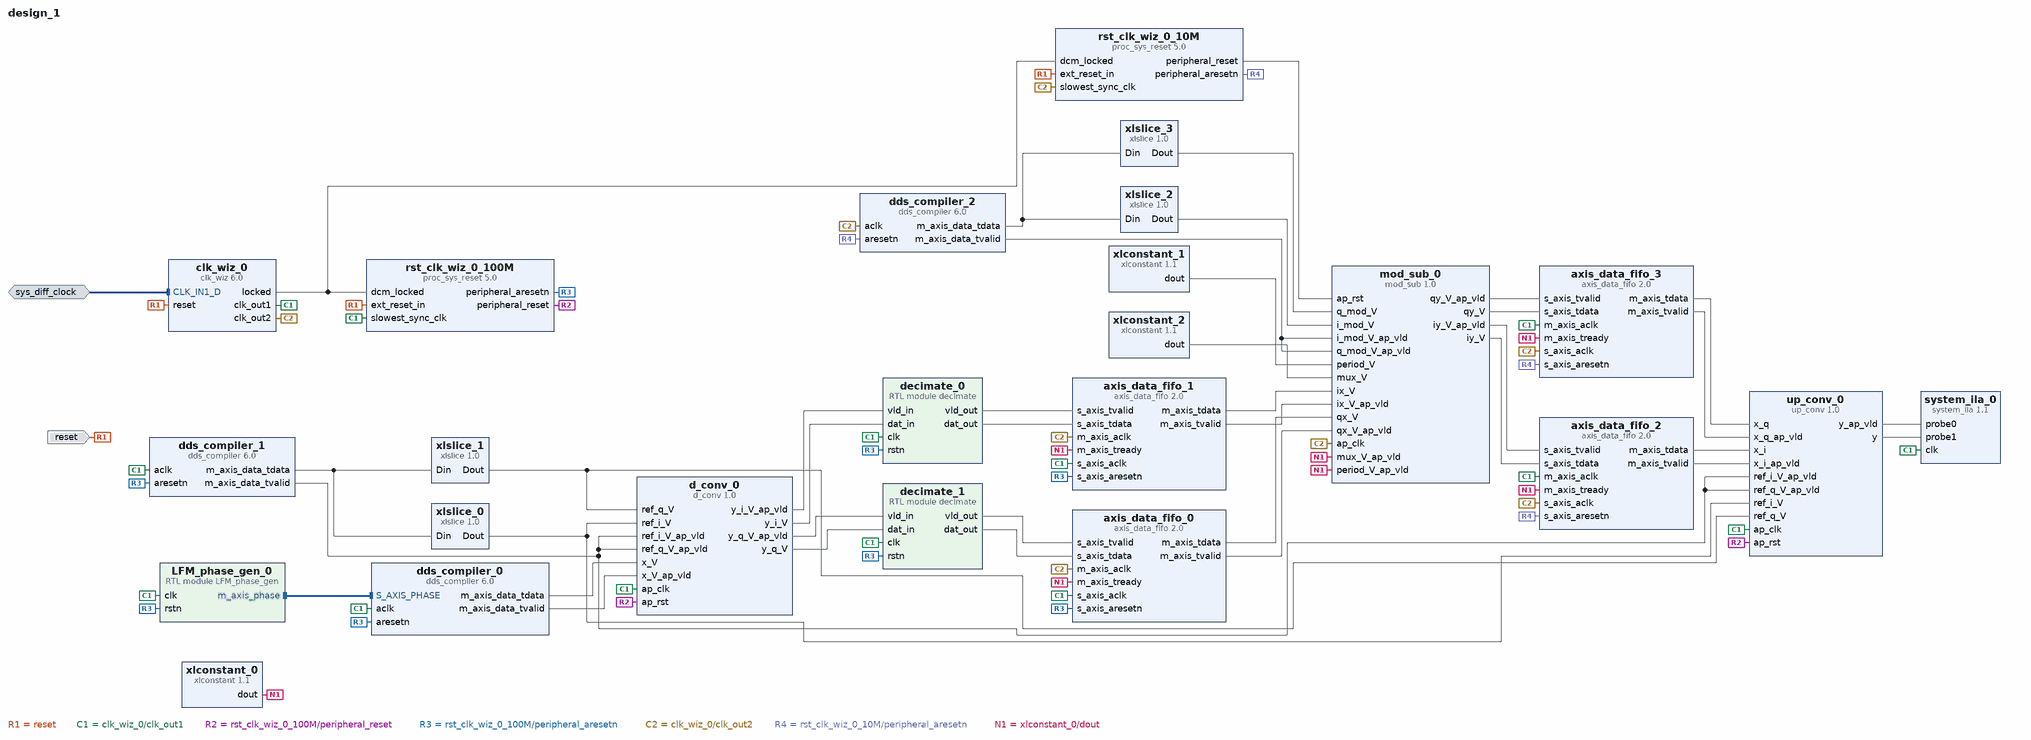
[diagram p0: block diagram of the top level]
# Vivado block design design_1, xc7z045ffg900-2, Vivado 2019.1.2
create_bd_design design_1

create_bd_intf_port -mode Slave -vlnv xilinx.com:interface:diff_clock_rtl:1.0 sys_diff_clock
set_property -dict {CONFIG.FREQ_HZ 200000000} [get_bd_intf_ports sys_diff_clock]
create_bd_port -dir I -type rst reset
set_property -dict {CONFIG.POLARITY ACTIVE_HIGH} [get_bd_ports reset]

create_bd_cell -type ip -vlnv xilinx.com:ip:dds_compiler:6.0 dds_compiler_0
set_property -dict [list \
  CONFIG.DATA_Has_TLAST Not_Required \
  CONFIG.Has_ARESETn true \
  CONFIG.Has_Phase_Out false \
  CONFIG.M_DATA_Has_TUSER Not_Required \
  CONFIG.Noise_Shaping None \
  CONFIG.Output_Frequency1 0 \
  CONFIG.Output_Selection Cosine \
  CONFIG.Output_Width 8 \
  CONFIG.PINC1 0 \
  CONFIG.Parameter_Entry Hardware_Parameters \
  CONFIG.Phase_Increment Streaming \
  CONFIG.Phase_Width 16 \
  CONFIG.S_PHASE_Has_TUSER Not_Required \
] [get_bd_cells dds_compiler_0]
create_bd_cell -type ip -vlnv xilinx.com:ip:dds_compiler:6.0 dds_compiler_1
set_property -dict [list \
  CONFIG.Has_ARESETn true \
  CONFIG.Has_Phase_Out false \
  CONFIG.M_DATA_Has_TUSER Not_Required \
  CONFIG.Noise_Shaping None \
  CONFIG.Output_Frequency1 0 \
  CONFIG.Output_Width 8 \
  CONFIG.PINC1 0100110011001101 \
  CONFIG.Parameter_Entry Hardware_Parameters \
  CONFIG.Phase_Width 16 \
] [get_bd_cells dds_compiler_1]
create_bd_cell -type ip -vlnv xilinx.com:ip:xlslice:1.0 xlslice_0
set_property -dict {CONFIG.DIN_FROM 7 CONFIG.DIN_TO 0 CONFIG.DIN_WIDTH 16 CONFIG.DOUT_WIDTH 8} [get_bd_cells xlslice_0]
create_bd_cell -type ip -vlnv xilinx.com:ip:xlslice:1.0 xlslice_1
set_property -dict {CONFIG.DIN_FROM 15 CONFIG.DIN_TO 8 CONFIG.DIN_WIDTH 16 CONFIG.DOUT_WIDTH 8} [get_bd_cells xlslice_1]
create_bd_cell -type module -reference LFM_phase_gen LFM_phase_gen_0
create_bd_cell -type ip -vlnv xilinx.com:ip:clk_wiz:6.0 clk_wiz_0
set_property -dict [list \
  CONFIG.CLKOUT2_JITTER 178.053 \
  CONFIG.CLKOUT2_PHASE_ERROR 89.971 \
  CONFIG.CLKOUT2_REQUESTED_OUT_FREQ 10.000 \
  CONFIG.CLKOUT2_USED true \
  CONFIG.CLK_IN1_BOARD_INTERFACE sys_diff_clock \
  CONFIG.MMCM_CLKOUT1_DIVIDE 100 \
  CONFIG.NUM_OUT_CLKS 2 \
  CONFIG.RESET_BOARD_INTERFACE reset \
  CONFIG.USE_BOARD_FLOW true \
] [get_bd_cells clk_wiz_0]
create_bd_cell -type ip -vlnv xilinx.com:hls:d_conv:1.0 d_conv_0
create_bd_cell -type ip -vlnv xilinx.com:ip:proc_sys_reset:5.0 rst_clk_wiz_0_100M
create_bd_cell -type ip -vlnv xilinx.com:ip:system_ila:1.1 system_ila_0
set_property -dict {CONFIG.C_MON_TYPE NATIVE CONFIG.C_NUM_OF_PROBES 2} [get_bd_cells system_ila_0]
create_bd_cell -type module -reference decimate decimate_0
create_bd_cell -type module -reference decimate decimate_1
create_bd_cell -type ip -vlnv xilinx.com:ip:axis_data_fifo:2.0 axis_data_fifo_0
set_property -dict {CONFIG.FIFO_DEPTH 16 CONFIG.IS_ACLK_ASYNC 1 CONFIG.TDATA_NUM_BYTES 4} [get_bd_cells axis_data_fifo_0]
create_bd_cell -type ip -vlnv xilinx.com:ip:axis_data_fifo:2.0 axis_data_fifo_1
set_property -dict {CONFIG.FIFO_DEPTH 16 CONFIG.IS_ACLK_ASYNC 1 CONFIG.TDATA_NUM_BYTES 4} [get_bd_cells axis_data_fifo_1]
create_bd_cell -type ip -vlnv xilinx.com:ip:axis_data_fifo:2.0 axis_data_fifo_2
set_property -dict {CONFIG.FIFO_DEPTH 16 CONFIG.IS_ACLK_ASYNC 1 CONFIG.TDATA_NUM_BYTES 4} [get_bd_cells axis_data_fifo_2]
create_bd_cell -type ip -vlnv xilinx.com:ip:axis_data_fifo:2.0 axis_data_fifo_3
set_property -dict {CONFIG.FIFO_DEPTH 16 CONFIG.IS_ACLK_ASYNC 1 CONFIG.TDATA_NUM_BYTES 4} [get_bd_cells axis_data_fifo_3]
create_bd_cell -type ip -vlnv xilinx.com:hls:mod_sub:1.0 mod_sub_0
create_bd_cell -type ip -vlnv xilinx.com:ip:dds_compiler:6.0 dds_compiler_2
set_property -dict [list \
  CONFIG.DDS_Clock_Rate 10 \
  CONFIG.Has_ARESETn true \
  CONFIG.Has_Phase_Out false \
  CONFIG.M_DATA_Has_TUSER Not_Required \
  CONFIG.Negative_Sine true \
  CONFIG.Noise_Shaping None \
  CONFIG.Output_Frequency1 0 \
  CONFIG.Output_Width 8 \
  CONFIG.PINC1 0000110011001101 \
  CONFIG.Parameter_Entry Hardware_Parameters \
  CONFIG.Phase_Width 16 \
] [get_bd_cells dds_compiler_2]
create_bd_cell -type ip -vlnv xilinx.com:ip:proc_sys_reset:5.0 rst_clk_wiz_0_10M
create_bd_cell -type ip -vlnv xilinx.com:ip:xlslice:1.0 xlslice_2
set_property -dict {CONFIG.DIN_FROM 7 CONFIG.DIN_TO 0 CONFIG.DIN_WIDTH 16 CONFIG.DOUT_WIDTH 8} [get_bd_cells xlslice_2]
create_bd_cell -type ip -vlnv xilinx.com:ip:xlslice:1.0 xlslice_3
set_property -dict {CONFIG.DIN_FROM 15 CONFIG.DIN_TO 8 CONFIG.DIN_WIDTH 16 CONFIG.DOUT_WIDTH 8} [get_bd_cells xlslice_3]
create_bd_cell -type ip -vlnv xilinx.com:ip:xlconstant:1.1 xlconstant_0
create_bd_cell -type ip -vlnv xilinx.com:ip:xlconstant:1.1 xlconstant_1
set_property -dict {CONFIG.CONST_VAL 100 CONFIG.CONST_WIDTH 8} [get_bd_cells xlconstant_1]
create_bd_cell -type ip -vlnv xilinx.com:ip:xlconstant:1.1 xlconstant_2
set_property -dict {CONFIG.CONST_VAL 0 CONFIG.CONST_WIDTH 2} [get_bd_cells xlconstant_2]
create_bd_cell -type ip -vlnv xilinx.com:hls:up_conv:1.0 up_conv_0

# ---- connections ----

connect_bd_intf_net [get_bd_intf_pins LFM_phase_gen_0/m_axis_phase] [get_bd_intf_pins dds_compiler_0/S_AXIS_PHASE]
connect_bd_intf_net [get_bd_intf_ports sys_diff_clock] [get_bd_intf_pins clk_wiz_0/CLK_IN1_D]
connect_bd_net [get_bd_ports reset] \
  [get_bd_pins clk_wiz_0/reset] [get_bd_pins rst_clk_wiz_0_100M/ext_reset_in] [get_bd_pins rst_clk_wiz_0_10M/ext_reset_in]
connect_bd_net [get_bd_pins clk_wiz_0/clk_out1] \
  [get_bd_pins d_conv_0/ap_clk] [get_bd_pins rst_clk_wiz_0_100M/slowest_sync_clk] [get_bd_pins LFM_phase_gen_0/clk] \
  [get_bd_pins dds_compiler_0/aclk] [get_bd_pins dds_compiler_1/aclk] [get_bd_pins system_ila_0/clk] \
  [get_bd_pins decimate_0/clk] [get_bd_pins decimate_1/clk] [get_bd_pins axis_data_fifo_1/s_axis_aclk] \
  [get_bd_pins axis_data_fifo_0/s_axis_aclk] [get_bd_pins axis_data_fifo_2/m_axis_aclk] \
  [get_bd_pins axis_data_fifo_3/m_axis_aclk] [get_bd_pins up_conv_0/ap_clk]
connect_bd_net [get_bd_pins clk_wiz_0/locked] [get_bd_pins rst_clk_wiz_0_100M/dcm_locked] [get_bd_pins rst_clk_wiz_0_10M/dcm_locked]
connect_bd_net [get_bd_pins rst_clk_wiz_0_100M/peripheral_reset] [get_bd_pins d_conv_0/ap_rst] [get_bd_pins up_conv_0/ap_rst]
connect_bd_net [get_bd_pins rst_clk_wiz_0_100M/peripheral_aresetn] \
  [get_bd_pins LFM_phase_gen_0/rstn] [get_bd_pins dds_compiler_0/aresetn] [get_bd_pins dds_compiler_1/aresetn] \
  [get_bd_pins decimate_0/rstn] [get_bd_pins decimate_1/rstn] [get_bd_pins axis_data_fifo_1/s_axis_aresetn] \
  [get_bd_pins axis_data_fifo_0/s_axis_aresetn]
connect_bd_net [get_bd_pins dds_compiler_1/m_axis_data_tdata] [get_bd_pins xlslice_0/Din] [get_bd_pins xlslice_1/Din]
connect_bd_net [get_bd_pins dds_compiler_1/m_axis_data_tvalid] \
  [get_bd_pins d_conv_0/ref_i_V_ap_vld] [get_bd_pins d_conv_0/ref_q_V_ap_vld] [get_bd_pins up_conv_0/ref_i_V_ap_vld] \
  [get_bd_pins up_conv_0/ref_q_V_ap_vld]
connect_bd_net [get_bd_pins xlslice_0/Dout] [get_bd_pins d_conv_0/ref_i_V] [get_bd_pins up_conv_0/ref_i_V]
connect_bd_net [get_bd_pins xlslice_1/Dout] [get_bd_pins d_conv_0/ref_q_V] [get_bd_pins up_conv_0/ref_q_V]
connect_bd_net [get_bd_pins dds_compiler_0/m_axis_data_tdata] [get_bd_pins d_conv_0/x_V]
connect_bd_net [get_bd_pins dds_compiler_0/m_axis_data_tvalid] [get_bd_pins d_conv_0/x_V_ap_vld]
connect_bd_net [get_bd_pins d_conv_0/y_i_V_ap_vld] [get_bd_pins decimate_0/vld_in]
connect_bd_net [get_bd_pins d_conv_0/y_i_V] [get_bd_pins decimate_0/dat_in]
connect_bd_net [get_bd_pins d_conv_0/y_q_V_ap_vld] [get_bd_pins decimate_1/vld_in]
connect_bd_net [get_bd_pins d_conv_0/y_q_V] [get_bd_pins decimate_1/dat_in]
connect_bd_net [get_bd_pins clk_wiz_0/clk_out2] \
  [get_bd_pins mod_sub_0/ap_clk] [get_bd_pins rst_clk_wiz_0_10M/slowest_sync_clk] [get_bd_pins dds_compiler_2/aclk] \
  [get_bd_pins axis_data_fifo_0/m_axis_aclk] [get_bd_pins axis_data_fifo_1/m_axis_aclk] \
  [get_bd_pins axis_data_fifo_2/s_axis_aclk] [get_bd_pins axis_data_fifo_3/s_axis_aclk]
connect_bd_net [get_bd_pins rst_clk_wiz_0_10M/peripheral_reset] [get_bd_pins mod_sub_0/ap_rst]
connect_bd_net [get_bd_pins dds_compiler_2/m_axis_data_tdata] [get_bd_pins xlslice_3/Din] [get_bd_pins xlslice_2/Din]
connect_bd_net [get_bd_pins xlslice_2/Dout] [get_bd_pins mod_sub_0/i_mod_V]
connect_bd_net [get_bd_pins xlslice_3/Dout] [get_bd_pins mod_sub_0/q_mod_V]
connect_bd_net [get_bd_pins dds_compiler_2/m_axis_data_tvalid] [get_bd_pins mod_sub_0/i_mod_V_ap_vld] [get_bd_pins mod_sub_0/q_mod_V_ap_vld]
connect_bd_net [get_bd_pins decimate_0/vld_out] [get_bd_pins axis_data_fifo_1/s_axis_tvalid]
connect_bd_net [get_bd_pins decimate_0/dat_out] [get_bd_pins axis_data_fifo_1/s_axis_tdata]
connect_bd_net [get_bd_pins decimate_1/vld_out] [get_bd_pins axis_data_fifo_0/s_axis_tvalid]
connect_bd_net [get_bd_pins decimate_1/dat_out] [get_bd_pins axis_data_fifo_0/s_axis_tdata]
connect_bd_net [get_bd_pins rst_clk_wiz_0_10M/peripheral_aresetn] \
  [get_bd_pins dds_compiler_2/aresetn] [get_bd_pins axis_data_fifo_2/s_axis_aresetn] \
  [get_bd_pins axis_data_fifo_3/s_axis_aresetn]
connect_bd_net [get_bd_pins axis_data_fifo_1/m_axis_tdata] [get_bd_pins mod_sub_0/ix_V]
connect_bd_net [get_bd_pins axis_data_fifo_1/m_axis_tvalid] [get_bd_pins mod_sub_0/ix_V_ap_vld]
connect_bd_net [get_bd_pins axis_data_fifo_0/m_axis_tdata] [get_bd_pins mod_sub_0/qx_V]
connect_bd_net [get_bd_pins axis_data_fifo_0/m_axis_tvalid] [get_bd_pins mod_sub_0/qx_V_ap_vld]
connect_bd_net [get_bd_pins xlconstant_0/dout] \
  [get_bd_pins axis_data_fifo_1/m_axis_tready] [get_bd_pins axis_data_fifo_0/m_axis_tready] \
  [get_bd_pins mod_sub_0/period_V_ap_vld] [get_bd_pins mod_sub_0/mux_V_ap_vld] [get_bd_pins axis_data_fifo_2/m_axis_tready] \
  [get_bd_pins axis_data_fifo_3/m_axis_tready]
connect_bd_net [get_bd_pins xlconstant_1/dout] [get_bd_pins mod_sub_0/period_V]
connect_bd_net [get_bd_pins xlconstant_2/dout] [get_bd_pins mod_sub_0/mux_V]
connect_bd_net [get_bd_pins mod_sub_0/iy_V_ap_vld] [get_bd_pins axis_data_fifo_2/s_axis_tvalid]
connect_bd_net [get_bd_pins mod_sub_0/qy_V_ap_vld] [get_bd_pins axis_data_fifo_3/s_axis_tvalid]
connect_bd_net [get_bd_pins mod_sub_0/iy_V] [get_bd_pins axis_data_fifo_2/s_axis_tdata]
connect_bd_net [get_bd_pins mod_sub_0/qy_V] [get_bd_pins axis_data_fifo_3/s_axis_tdata]
connect_bd_net [get_bd_pins axis_data_fifo_2/m_axis_tdata] [get_bd_pins up_conv_0/x_i]
connect_bd_net [get_bd_pins axis_data_fifo_3/m_axis_tdata] [get_bd_pins up_conv_0/x_q]
connect_bd_net [get_bd_pins axis_data_fifo_3/m_axis_tvalid] [get_bd_pins up_conv_0/x_q_ap_vld]
connect_bd_net [get_bd_pins axis_data_fifo_2/m_axis_tvalid] [get_bd_pins up_conv_0/x_i_ap_vld]
connect_bd_net [get_bd_pins up_conv_0/y_ap_vld] [get_bd_pins system_ila_0/probe0]
connect_bd_net [get_bd_pins up_conv_0/y] [get_bd_pins system_ila_0/probe1]

validate_bd_design
save_bd_design
